# EAGLE design VentaConnected_ESP8266_V0.01_2017-11-26 (EAGLE 8.3.2)
VERSION: 0.01
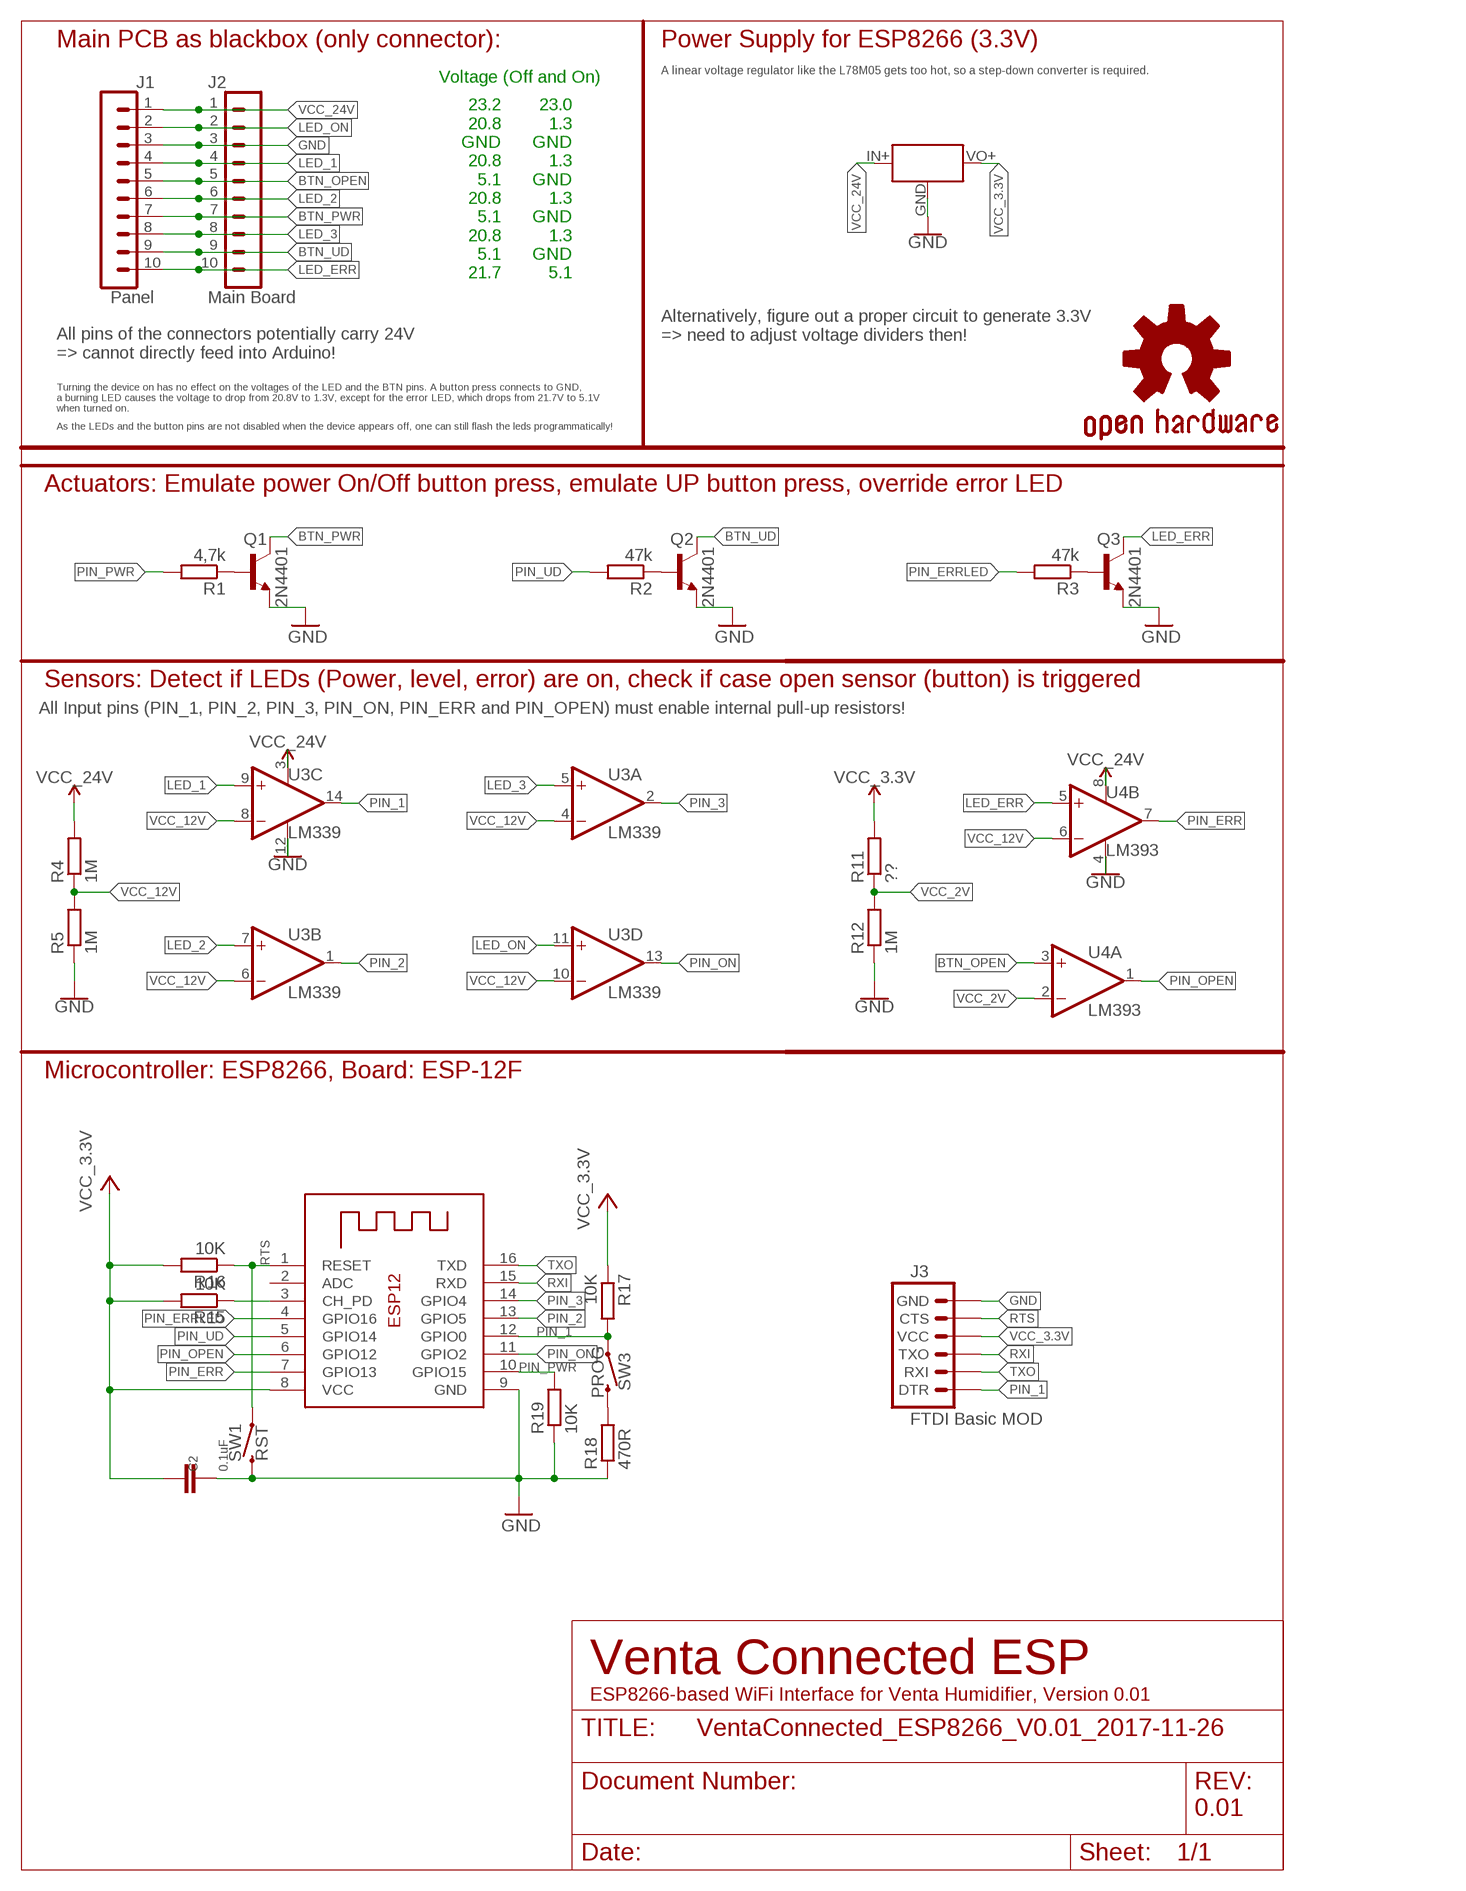
[diagram p0: schematic, sheet 1]

## Parts
C2  0.1uF  C-EUC0805  [C0805]
GOLD_ORB_SM1  OSHWLOGO_GOLD_ORB_SM  [OSHW2]
J1  Panel  CONN_05X2SHD  [2X5-SHROUDED]
J2  Main Board  CONN_05X2PTH  [2X5]
J3  FTDI Basic MOD  ARDUINO_SERIAL_PROGRAMPTH  [1X06]
Q1  2N4401  MMBT4401LT1-NPN-SOT23-BEC  [SOT23-BEC]
Q2  2N4401  MMBT4401LT1-NPN-SOT23-BEC  [SOT23-BEC]
Q3  2N4401  MMBT4401LT1-NPN-SOT23-BEC  [SOT23-BEC]
R1  4,7k  R-EU_R0805  [R0805]
R2  47k  R-EU_R0805  [R0805]
R3  47k  R-EU_R0805  [R0805]
R4  1M  R-EU_R0805  [R0805]
R5  1M  R-EU_R0805  [R0805]
R11  ??  R-EU_R0805  [R0805]
R12  1M  R-EU_R0805  [R0805]
R15  10K  R-EU_R0805  [R0805]
R16  10K  R-EU_R0805  [R0805]
R17  10K  R-EU_R0805  [R0805]
R18  470R  R-EU_R0805  [R0805]
R19  10K  R-EU_R0805  [R0805]
SW1  RST  MOMENTARY-SWITCH-SPST-SMD-6.0X3.5MM  [TACTILE_SWITCH_SMD_6.0X3.5MM]
SW3  PROG  MOMENTARY-SWITCH-SPST-SMD-6.0X3.5MM  [TACTILE_SWITCH_SMD_6.0X3.5MM]
U2  3.3V_BUCK_CONVERTER  MINI_BUCK_CONVERTER_UPSIDEDOWN  [MINI_BUCK_CONVERTER_UPDOWN]
U3  LM339  TLC339D  [SO14]
U4  LM393  LM393D  [SO08]
X2  ESP-12e  ESP-12  [ESP-12]

## Nets
BTN_OPEN: J1.5 J2.5 U4.3(A:+IN)
BTN_PWR: J1.7 J2.7 Q1.C
BTN_UD: J1.9 J2.9 Q2.C
CH_PD: R15.1 X2.3(CH_PD)
GND: C2.1 J1.3 J2.3 J3.6(GND) Q1.E Q2.E Q3.E R5.1 R12.1 R18.1 R19.1 SW1.2 U2.GND U3.12(P:V-) U4.4(P:V-) X2.9(GND)
LED_1: J1.4 J2.4 U3.9(C:+IN)
LED_2: J1.6 J2.6 U3.7(B:+IN)
LED_3: J1.8 J2.8 U3.5(A:+IN)
LED_ERR: J1.10 J2.10 Q3.C U4.5(B:+IN)
LED_ON: J1.2 J2.2 U3.11(D:+IN)
N$2: Q1.B R1.1
N$4: R18.2 SW3.2
N$5: Q3.B R3.1
N$6: Q2.B R2.1
PIN_1: J3.1(DTR) R17.2 SW3.1 U3.14(C:OUT) X2.12(GPIO0)
PIN_2: U3.1(B:OUT) X2.13(GPIO5)
PIN_3: U3.2(A:OUT) X2.14(GPIO4)
PIN_ERR: U4.7(B:OUT) X2.7(GPIO13)
PIN_ERRLED: R3.2 X2.4(GPIO16)
PIN_ON: U3.13(D:OUT) X2.11(GPIO2)
PIN_OPEN: U4.1(A:OUT) X2.6(GPIO12)
PIN_PWR: R1.2 R19.2 X2.10(GPIO15)
PIN_UD: R2.2 X2.5(GPIO14)
RTS: J3.5(CTS) R16.1 SW1.1 X2.1(RESET)
RXI: J3.3(TXO) X2.15(RXD)
TXO: J3.2(RXI) X2.16(TXD)
VCC_2V: R11.1 R12.2 U4.2(A:-IN)
VCC_3.3V: C2.2 J3.4(VCC) R11.2 R15.2 R16.2 R17.1 U2.VO+(VOUT) X2.8(VCC)
VCC_12V: R4.1 R5.2 U3.4(A:-IN) U3.6(B:-IN) U3.8(C:-IN) U3.10(D:-IN) U4.6(B:-IN)
VCC_24V: J1.1 J2.1 R4.2 U2.IN+(VIN) U3.3(P:V+) U4.8(P:V+)
Unconnected: X2.2(ADC)

## Notes on the sheet
- Main PCB as blackbox (only connector): | Power Supply for ESP8266 (3.3V)
- A linear voltage regulator like the L78M05 gets too hot, so a step-down converter is required.
- Voltage (Off and On)
- 23.2
  20.8
  GND
  20.8
  5.1
  20.8
  5.1
  20.8
  5.1
  21.7
- 23.0
  1.3
  GND
  1.3
  GND
  1.3
  GND
  1.3
  GND
  5.1
- Alternatively, figure out a proper circuit to generate 3.3V 
  => need to adjust voltage dividers then!
- All pins of the connectors potentially carry 24V 
  => cannot directly feed into Arduino!
- Turning the device on has no effect on the voltages of the LED and the BTN pins. A button press connects to GND, 
  a burning LED causes the voltage to drop from 20.8V to 1.3V, except for the error LED, which drops from 21.7V to 5.1V 
  when turned on.
- As the LEDs and the button pins are not disabled when the device appears off, one can still flash the leds programmatically!
- Actuators: Emulate power On/Off button press, emulate UP button press, override error LED
- Sensors: Detect if LEDs (Power, level, error) are on, check if case open sensor (button) is triggered
- All Input pins (PIN_1, PIN_2, PIN_3, PIN_ON, PIN_ERR and PIN_OPEN) must enable internal pull-up resistors!
- Microcontroller: ESP8266, Board: ESP-12F
- Venta Connected ESP
- ESP8266-based WiFi Interface for Venta Humidifier, Version 0.01

## Library data of the parts
C2 = resistor:C-EU: CAPACITOR, European symbol
GOLD_ORB_SM1 = bfl:OSHWLOGO: These are Open-Source Hardware logos.
J1 = opentools:CONN_05X2: Multi connection point. Often used as Generic Header-pin footprint for 0.1 inch spaced/style header connections For AVR SPI programming port, see special device with nice symbol: "AVR_SPI_PROG_5x2.dev" You can populate with any combo of single row headers, but if you'd like an exact match, check these: 2x5 AVR ICSP Male Header <https://www.sparkfun.com/products/778> (PRT-00778) 2x5 Pin Shrouded Header <https://www.sparkfun.com/products/8506> (PRT-08506) On any of the 0.1 inch spaced packages, you can populate with these: Break Away Headers - Straight <https://www.sparkfun.com/products/116> (PRT-00116) Break Away Male Headers - Right Angle <https://www.sparkfun.com/products/553> (PRT-00553) Female Headers <https://www.sparkfun.com/products/115> (PRT-00115) Break Away Headers - Machine Pin <https://www.sparkfun.com/products/117> (PRT-00117) Break Away Female Headers - Swiss Machine Pin <https://www.sparkfun.com/products/743> (PRT-00743) Special note: the shrouded connector mates well with our 5x2 ribbon cables: 2x5 Pin IDC Ribbon Cable <https://www.sparkfun.com/products/8535> (PRT-08535); PROD_ID: CONN-08671; SF_ID: PRT-08506
J2 = opentools:CONN_05X2: Multi connection point. Often used as Generic Header-pin footprint for 0.1 inch spaced/style header connections For AVR SPI programming port, see special device with nice symbol: "AVR_SPI_PROG_5x2.dev" You can populate with any combo of single row headers, but if you'd like an exact match, check these: 2x5 AVR ICSP Male Header <https://www.sparkfun.com/products/778> (PRT-00778) 2x5 Pin Shrouded Header <https://www.sparkfun.com/products/8506> (PRT-08506) On any of the 0.1 inch spaced packages, you can populate with these: Break Away Headers - Straight <https://www.sparkfun.com/products/116> (PRT-00116) Break Away Male Headers - Right Angle <https://www.sparkfun.com/products/553> (PRT-00553) Female Headers <https://www.sparkfun.com/products/115> (PRT-00115) Break Away Headers - Machine Pin <https://www.sparkfun.com/products/117> (PRT-00117) Break Away Female Headers - Swiss Machine Pin <https://www.sparkfun.com/products/743> (PRT-00743) Special note: the shrouded connector mates well with our 5x2 ribbon cables: 2x5 Pin IDC Ribbon Cable <https://www.sparkfun.com/products/8535> (PRT-08535); PROD_ID: CONN-08499; SF_ID: PRT-0778
J3 = SparkFun:ARDUINO_SERIAL_PROGRAM
Q1-Q3 = transistor-neu-to92:*-NPN-: NPN Transistror
R1-R5 R11 R12 = resistor:R-EU_: RESISTOR, European symbol
R15-R19 = rcl:R-EU_: RESISTOR, European symbol
SW1 SW3 = SparkFun-Switches:MOMENTARY-SWITCH-SPST: Momentary Switch (Pushbutton) - SPST Normally-open (NO) SPST momentary switches (buttons, pushbuttons). Variants PTH-12MM - 12mm square, through-hole Momentary Pushbutton Switch - 12mm Square <https://www.sparkfun.com/products/9190> (COM-09190) PTH-6.0MM, PTH-6.0MM-KIT - 6.0mm square, through-hole Mini Pushbutton Switch <https://www.sparkfun.com/products/97> (COM-00097) KIT package intended for soldering kit's - only one side of pads' copper is exposed. PTH-RIGHT-ANGLE-KIT - Right-angle, through-hole Right Angle Tactile Button <https://www.sparkfun.com/products/10791> - Used on SparkFun BigTime Watch Kit <https://www.sparkfun.com/products/11734> SMD-12MM - 12mm square, surface-mount Tactile Button - SMD (12mm) <https://www.sparkfun.com/products/12993> (COM-12993) Used on SparkFun PicoBoard <https://www.sparkfun.com/products/11888> SMD-4.5MM - 4.5mm Square Trackball Switch Used on SparkFun Blackberry Trackballer Breakout <https://www.sparkfun.com/products/13169> SMD-4.6MMX2.8MM - 4.60mm x 2.80mm, surface mount Used on SparkFun SAMD21 Mini Breakout <https://www.sparkfun.com/products/13664> SMD-5.2MM, SMD-5.2-REDUNDANT - 5.2mm square, surface-mount Mini Pushbutton Switch - SMD <https://www.sparkfun.com/products/8720> (COM-08720) Used on Arduino Pro Mini <https://www.sparkfun.com/products/11114> REDUNDANT package connects both switch circuits together SMD-6.0X3.5MM - 6.0 x 3.5mm, surface mount Momentary Reset Switch SMD <https://www.sparkfun.com/products/8229> (COM-08229) SMD-6.2MM-TALL - 6.2mm square, surface mount Tactile Button - SMD (6mm) <https://www.sparkfun.com/products/12992> Used on SparkFun Digital Sandbox <https://www.sparkfun.com/products/12651> SMD-RIGHT-ANGLE - Right-angle, surface mount Used on SparkFun Block for Intel® Edison - Arduino <https://www.sparkfun.com/products/13036>; PROD_ID: SWCH-00815; SF_SKU: COM-08229
U2 = opentools:MINI_BUCK_CONVERTER: 4.5-40V Step Down Buck Converter
U3 = linear:TLC339: COMPARATOR
U4 = linear:LM393: COMPARATOR
X2 = adafruit:ESP-12

## Net classes
0 default: width 0.203 mm
1 vcc: width 0.254 mm

## Board
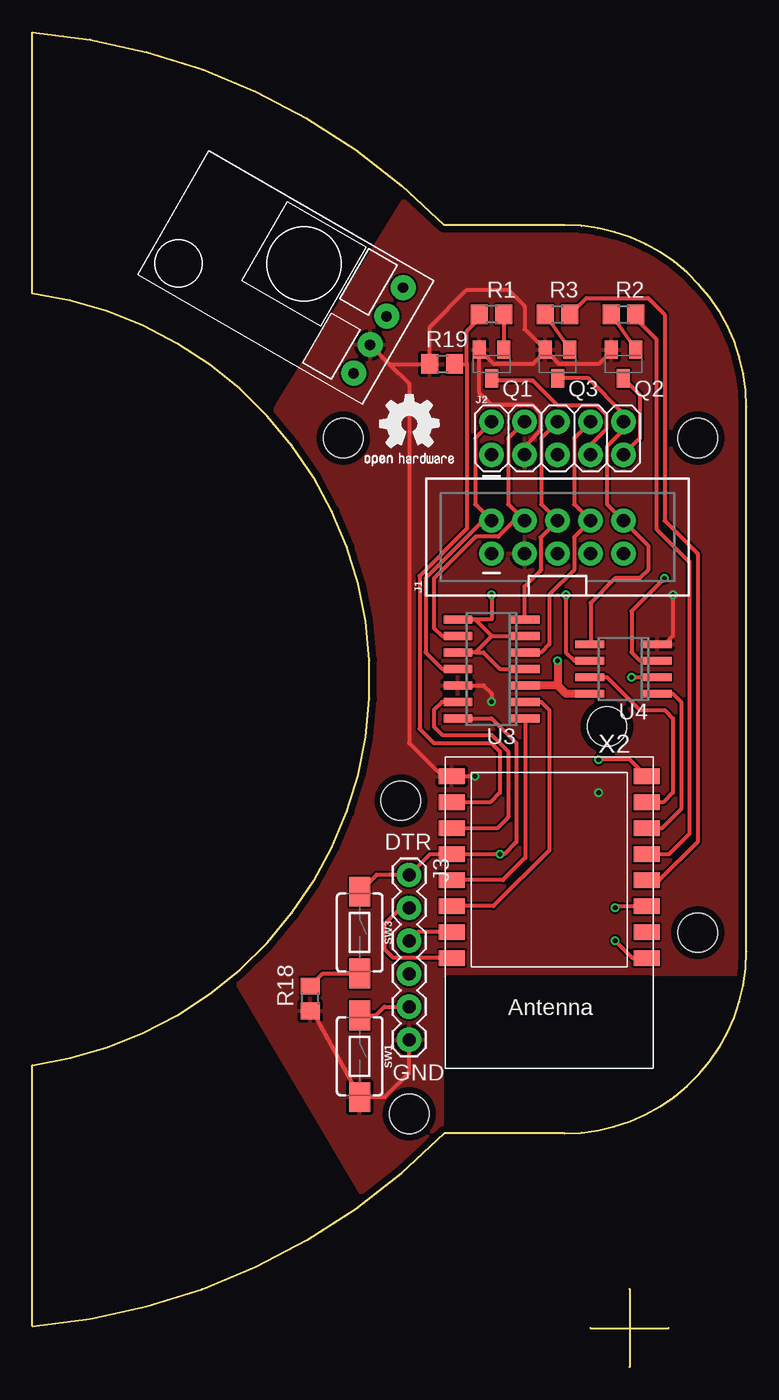
[diagram p1: board, top side]
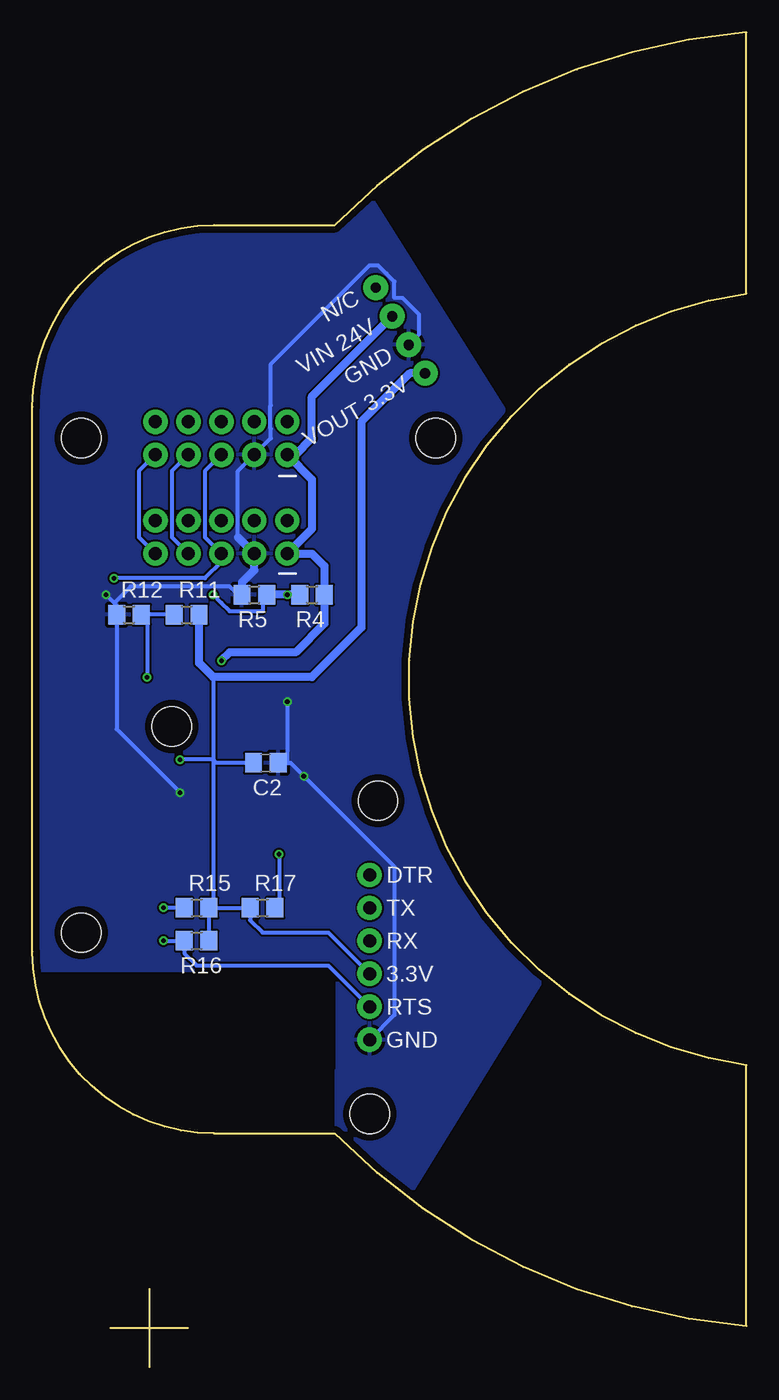
[diagram p2: board, bottom side, seen from below]

Size 55 x 102.85 mm. Coordinates in mm from the lower left corner, seen from the top.
Outline: 46,6 46,0
Outline: 43,3 49,3
Outline: 41,18 arc90 55,32 55,74 arc90 41,88 31.71,88 arc41 0,102.85 0,82.73 arc-165 0,23.27 0,3.16 arc41 31.71,18 41,18
Copper layers (1*16): Top 0.035mm / dielectric 1.6mm / Bottom 0.035mm
Design rules "Elecrow_2-layer_PCB_eagle_rule": minimum track width 6mil, minimum drill 12mil, track to track 6mil, track to pad 6mil, pad to pad 6mil, via to via 8mil, smd to smd 0mil, copper to edge 20mil, drill to drill 10mil, minimum pad ring 6mil, minimum via ring 6mil, stop-mask expansion 0mil, vias tented up to drill 100mil, thermal gap 10mil
Holes 3.05 mm at 23.94,71.58 51.24,71.58 51.24,33.48 28.38,43.64 29.02,19.51 44.26,49.35

### Footprints (pad centres in the part's own frame; a part is rotated, then mirrored left to right if it is on the bottom)
C0805 = smd 1.3 x 1.5: 1 -0.95,0; 2 0.95,0
2X5-SHROUDED = drill 1.016 pad 1.88: 1 -1.27,5.08; 2 1.27,5.08; 3 -1.27,2.54; 4 1.27,2.54; 5 -1.27,0; 6 1.27,0; 7 -1.27,-2.54; 8 1.27,-2.54; 9 -1.27,-5.08; 10 1.27,-5.08
2X5 = drill 1.016 pad 1.88: 1 0,0; 2 0,2.54; 3 2.54,0; 4 2.54,2.54; 5 5.08,0; 6 5.08,2.54; 7 7.62,0; 8 7.62,2.54; 9 10.16,0; 10 10.16,2.54
1X06 = drill 1.016 pad 1.88: 1 0,0; 2 2.54,0; 3 5.08,0; 4 7.62,0; 5 10.16,0; 6 12.7,0
SOT23-BEC = smd 1 x 1.4: B -0.95,-1.1; C 0,1.1; E 0.95,-1.1
R0805 = smd 1.3 x 1.5: 1 -0.95,0; 2 0.95,0
TACTILE_SWITCH_SMD_6.0X3.5MM = smd 2.3 x 1.6: 1 -3.15,0; 2 3.15,0
MINI_BUCK_CONVERTER_UPDOWN = drill 0.8 pad 1.93: EN -1.27,1.27; GND -6.35,1.27; IN+ -3.81,1.27; VO+ -8.89,1.27
SO14 = smd 0.6 x 2.2: 1 -3.81,-2.6; 2 -2.54,-2.6; 3 -1.27,-2.6; 4 0,-2.6; 5 1.27,-2.6; 6 2.54,-2.6; 7 3.81,-2.6; 8 3.81,2.6; 9 2.54,2.6; 10 1.27,2.6; 11 0,2.6; 12 -1.27,2.6; 13 -2.54,2.6; 14 -3.81,2.6
SO08 = smd 0.6 x 2.2: 1 -1.905,-2.6; 2 -0.635,-2.6; 3 0.635,-2.6; 4 1.905,-2.6; 5 1.905,2.6; 6 0.635,2.6; 7 -0.635,2.6; 8 -1.905,2.6
ESP-12 = smd 2 x 1.2: 1 -7.5,4.5; 2 -7.5,2.5; 3 -7.5,0.5; 4 -7.5,-1.5; 5 -7.5,-3.5; 6 -7.5,-5.5; 7 -7.5,-7.5; 8 -7.5,-9.5; 9 7.5,-9.5; 10 7.5,-7.5; 11 7.5,-5.5; 12 7.5,-3.5; 13 7.5,-1.5; 14 7.5,0.5; 15 7.5,2.5; 16 7.5,4.5

### Placement (x,y rotation side)
C2  37.02,46.56 180 bottom
GOLD_ORB_SM1  25.21,68.41 0 top
J1  40.45,63.96 90 top
J2  35.37,70.31 0 top
J3  29.02,37.92 270 top
Q1  35.37,77.3 180 top
Q2  45.53,77.3 180 top
Q3  40.45,77.3 180 top
R1  35.37,81.11 180 top
R2  45.53,81.11 0 top
R3  40.45,81.11 0 top
R4  33.47,59.52 0 bottom
R5  37.91,59.52 0 bottom
R11  43.12,57.99 0 bottom
R12  47.56,57.99 0 bottom
R15  42.35,35.38 0 bottom
R16  42.35,32.84 0 bottom
R17  37.27,35.38 0 bottom
R18  21.4,28.4 90 top
R19  31.56,77.3 0 top
SW1  25.21,23.95 270 top
SW3  25.21,33.48 270 top
U2  30.29,83.64 60 top
U3  35.37,53.8 90 top
U4  45.53,53.8 90 top
X2  39.81,36.02 180 top

### Tracks (layer width: path | path; a pad name or v marks a point on that pad's centre or on a via)
BTN_OPEN  (via drill 0.35)
  Top 0.305: v48.7,60.78 46.16,58.24 46.16,55.07 46.8,54.44 U4.3
  Bottom 0.305: J2.5 41.72,69.04 41.72,63.96 J1.5 40.45,62.05 41.72,60.78 v48.7,60.78
BTN_PWR
  Top 0.305: Q1.C 35.54,76.03 38.55,76.03 40.48,74.09 43.51,74.09 44.23,73.37 44.23,72.33 42.99,71.09 J2.7
  Bottom 0.305: J2.7 44.26,69.04 44.26,63.96 J1.7
BTN_UD
  Top 0.305: 45.53,76.03 Q2.C 46.8,74.92 46.8,71.58 J2.9
  Bottom 0.305: J2.9 46.8,69.04 46.8,63.96 J1.9
CH_PD  (via drill 0.35)
  Top 0.305: v44.9,35.38 45.03,35.52 X2.3
  Bottom 0.305: R15.1 v44.9,35.38
GND  (via drill 0.35)
  Top 0.305: 32.34,45.55 v34.1,45.55 | 32.34,45.55 X2.9 | R18.1 21.75,27.11 SW1.2 27.14,20.8 29.02,22.68 J3.6 | J2.3 37.91,70.94 38.72,71.76 38.72,71.77 39.17,72.22 39.17,73.49 38.55,74.12 35.37,74.12 34.42,75.07 Q1.E 35.52,77.3 38.55,77.3 39.5,78.25 Q3.E | v49.34,59.52 49.34,56.34 48.7,55.7 U4.4 | U3.12 34.73,52.53 35.37,51.9 v35.37,51.26 | Q2.E 44.58,78.25 43.62,77.3 40.6,77.3 Q3.E | U2.GND 27.5,77.3 | 27.5,77.3 R19.1 30.61,80.16 33.47,83.01 36.64,83.01 37.91,81.74 37.91,79.98 Q3.E | 27.5,77.3 29.02,75.78 29.02,48.09 31.56,45.55 32.34,45.55
  Bottom 0.305: 39.18,63.96 39.18,69.04 J2.3 36.64,71.58 36.64,72.31 36.66,72.33 36.66,74.09 36.64,74.12 36.64,77.3 29.02,84.92 28.38,84.92 27.75,84.28 27.72,84.27 27.69,84.22 27.11,83.64 27.11,82.38 26.48,82.38 25.21,81.11 25.21,79.59 U2.GND | 35.37,46.56 C2.1 | 35.37,46.56 35.12,46.56 v34.1,45.55 27.11,38.56 27.11,27.13 J3.6 | v35.37,51.26 35.37,46.56 | 48.7,58.88 48.51,58.69 R12.1 48.51,49.16 v43.62,44.27 | 48.7,58.88 v49.34,59.52 | R5.1 39.18,59.52 39.81,60.15 47.44,60.15 48.7,58.88
  Bottom 0.61: R5.1 38.86,60.47 37.91,61.42 J1.3 39.18,63.96
  pour Top (isolate 0.152): 29.02,90.63 18.86,74.12 18.23,72.85 22.04,67.14 24.57,62.05 25.84,53.8 25.21,46.18 20.77,36.02 15.68,29.67 25.84,12.53 31.56,16.97 31.56,30.3 55.05,30.3 55.69,74.12 51.88,84.28 42.99,88.09 31.56,88.09
  pour Bottom (isolate 0.152): 29.02,90.25 18.23,73.1 20.13,69.93 23.94,62.31 25.84,55.32 25.21,45.8 19.5,34.37 15.68,29.92 25.84,13.41 29.02,15.32 31.56,17.86 31.56,30.56 55.05,30.56 55.69,73.74 51.88,83.9 42.99,87.71 31.56,87.71
LED_1
  Top 0.305: J2.4 36.64,71.58 36.64,66.5 J1.4 37.13,65.23 35.89,63.98 34.14,63.98 34.11,63.95 | 34.11,63.95 34.11,63.96 | 34.11,63.95 30.93,60.78 30.93,56.97 31.56,56.34 U3.9
LED_2
  Top 0.305: J2.6 39.18,71.58 39.18,66.5 J1.6 | J1.6 40.45,64.59 | J1.6 39.16,63.94 39.16,61.4 37.91,60.15 37.91,57.67 U3.7
LED_3
  Top 0.305: J2.8 41.72,71.58 41.72,66.5 J1.8 41.72,63.96 41.72,61.42 39.81,59.52 39.81,55.7 39.18,55.07 U3.5
LED_ERR
  Top 0.305: Q3.C 42.82,76.19 45.53,73.48 J2.10 45.53,72.22 44.26,70.94 44.26,66.5 J1.10 47.44,63.33 47.44,61.42 46.8,60.78 44.9,60.78 42.99,58.88 42.99,55.77 U4.5
LED_ON
  Top 0.305: J2.2 34.1,71.58 34.1,66.5 J1.2 34.73,65.23 30.29,60.78 30.29,55.07 31.56,53.8 U3.11
N$2
  Top 0.305: R1.1 Q1.B
N$4
  Top 0.305: R18.2 22.38,30.33 SW3.2
N$5
  Top 0.305: R3.1 Q3.B
N$6
  Top 0.305: R2.1 Q2.B
PIN_1  (via drill 0.35)
  Top 0.305: U3.14 35.37,49.99 37.27,48.09 37.27,40.47 36.33,39.52 v36.01,39.52 X2.12 30.62,39.52 J3.1 26.5,37.92 SW3.1
  Bottom 0.305: v36.01,39.52 36.01,35.7 R17.2
PIN_2
  Top 0.305: U3.1 37.97,39.26 36.23,37.52 X2.13
PIN_3
  Top 0.305: U3.2 39.18,51.26 39.81,50.62 39.81,39.83 35.51,35.52 X2.14
PIN_ERR
  Top 0.305: U4.7 44.26,53.16 46.8,50.62 48.7,50.62 49.34,49.99 49.34,44.27 48.59,43.52 X2.7
PIN_ERRLED
  Top 0.305: R3.2 42.67,82.38 47.44,82.38 48.7,81.11 48.7,65.23 51.24,62.69 51.24,40.47 48.3,37.52 X2.4
PIN_ON
  Top 0.305: U3.13 31.56,51.26 30.92,50.62 30.92,49.35 31.56,48.72 35.37,48.72 36.64,47.45 36.64,42.37 35.79,41.52 X2.11
PIN_OPEN
  Top 0.305: U4.1 49.34,51.9 49.98,51.26 49.98,43.01 48.49,41.52 X2.6
PIN_PWR
  Top 0.305: R1.2 34.42,80.79 33.47,79.83 33.47,77.3 | 33.47,77.3 33.47,64.61 29.83,60.97 29.83,49.18 30.92,48.09 35.36,48.09 36.01,47.44 36.01,44.27 35.25,43.52 X2.10 | R19.2 33.47,77.3
PIN_UD
  Top 0.305: R2.2 46.48,80.79 48.07,79.2 48.07,64.59 50.61,62.05 50.61,41.1 49.03,39.52 X2.5
RTS  (via drill 0.35)
  Top 0.305: X2.1 46.22,31.52 v44.9,32.84 | SW1.1 26.45,27.11 27.11,27.77 J3.5
  Bottom 0.305: v44.9,32.84 R16.1 43.3,31.89 42.35,30.94 32.2,30.94 J3.5
RXI
  Top 0.305: X2.15 29.7,33.52 J3.3
TXO
  Top 0.305: J3.2 28.38,35.38 27.11,34.11 27.11,32.21 27.75,31.57 32.26,31.57 X2.16
VCC_2V  (via drill 0.35)
  Top 0.305: v46.16,53.16 U4.2
  Bottom 0.305: R11.1 R12.2 46.16,57.54 v46.16,53.16
VCC_3.3V  (via drill 0.35)
  Top 0.305: v43.62,46.81 46.02,46.81 X2.8
  Bottom 0.305: 41.09,35.38 R17.1 38.23,34.43 37.27,33.48 32.2,33.48 J3.4 | 41.09,35.38 R15.2 R16.2 | 41.09,53.16 41.09,46.81 | 41.09,46.81 41.09,35.38 | C2.2 40.83,46.56 41.09,46.81 | 41.09,46.81 v43.62,46.81
  Bottom 0.61: U2.VO+ 25.92,76.58 29.66,72.85 29.66,56.98 33.47,53.16 41.09,53.16 42.17,54.25 R11.2
VCC_12V  (via drill 0.35)
  Top 0.305: 34.1,57.61 35.37,56.34 | 35.37,56.34 U3.6 | 35.37,56.34 34.1,55.07 | 34.1,55.07 U3.10 | 34.1,55.07 34.73,55.07 36.01,53.8 U3.4 | v35.37,59.52 35.37,57.61 34.1,57.61 | 34.1,57.61 32.83,57.61 | v41.09,59.52 41.09,55.07 41.72,54.44 U4.6 | U3.8 34.1,57.61
  Bottom 0.305: R5.2 37.27,59.2 37.27,58.24 39.81,58.24 40.45,58.88 v41.09,59.52
  Bottom 0.61: R4.1 v35.37,59.52 R5.2
VCC_24V  (via drill 0.35)
  Top 0.61: v40.45,54.44 40.45,52.53 | 40.45,52.53 U3.3 | 40.45,52.53 41.09,51.9 U4.8
  Bottom 0.61: U2.IN+ 33.47,74.8 33.47,71.58 34.73,70.31 J2.1 33.47,68.41 33.47,64.59 J1.1 33.47,62.69 32.52,61.74 R4.2 32.52,57.29 34.73,55.07 39.81,55.07 v40.45,54.44

### Text on the board
tOrigins: PROG | RESET
bOrigins: VentaConnected for ESP8266 / R. Kainhofer / Version 0.01, 26.11.2017
tNames: DTR | GND
bNames: N/C / VIN 24V / GND / VOUT 3.3V | DTR / TX / RX / 3.3V / RTS / GND